# Altium schematic sheet schematic.SchDoc
size A2
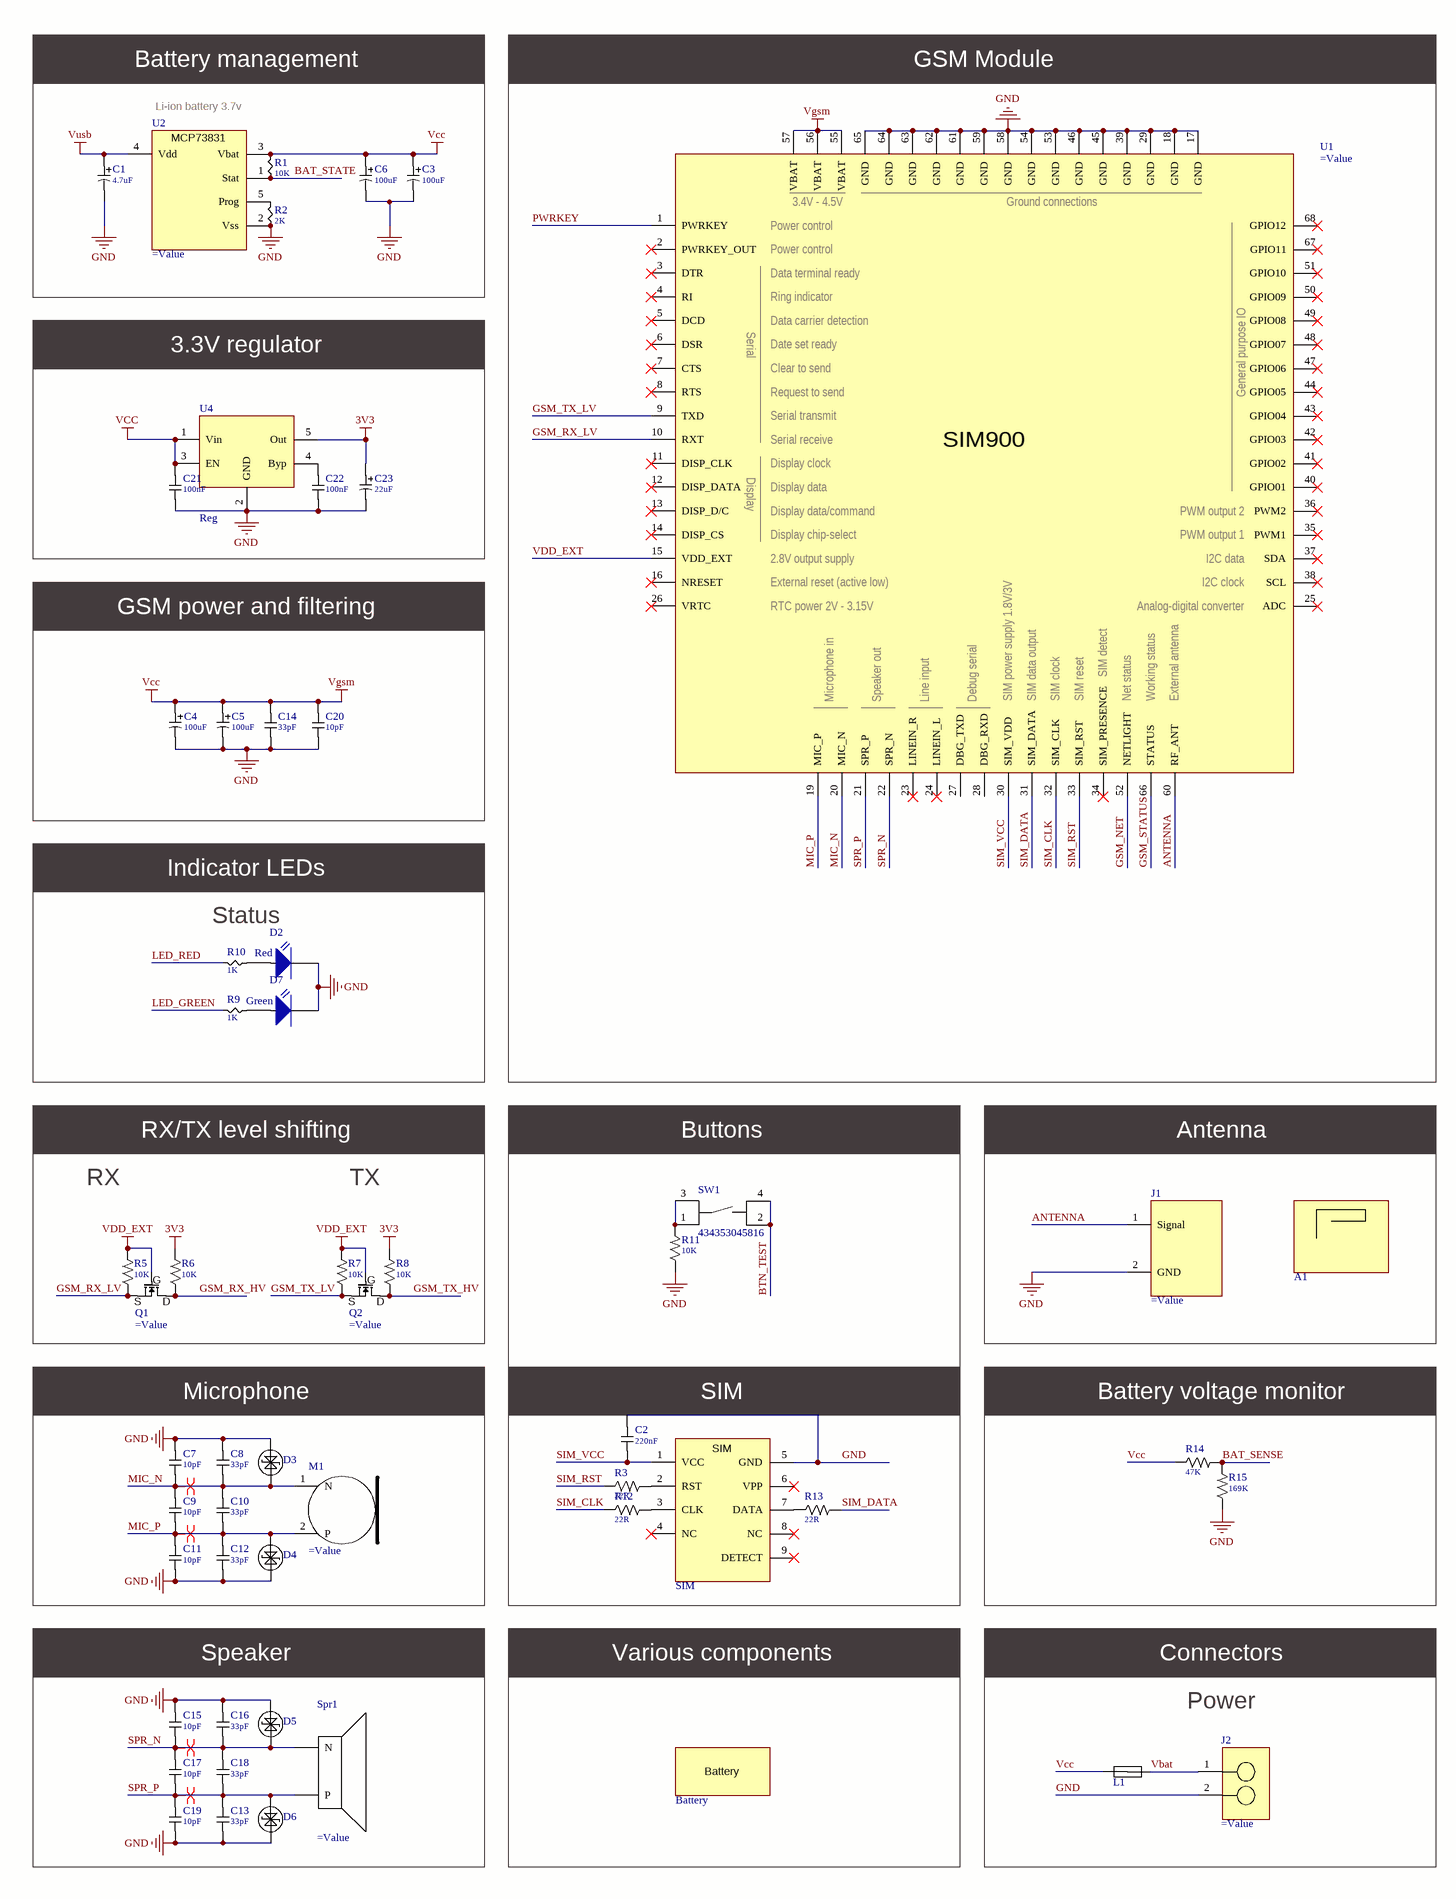
[diagram p0: schematic.SchDoc, left]
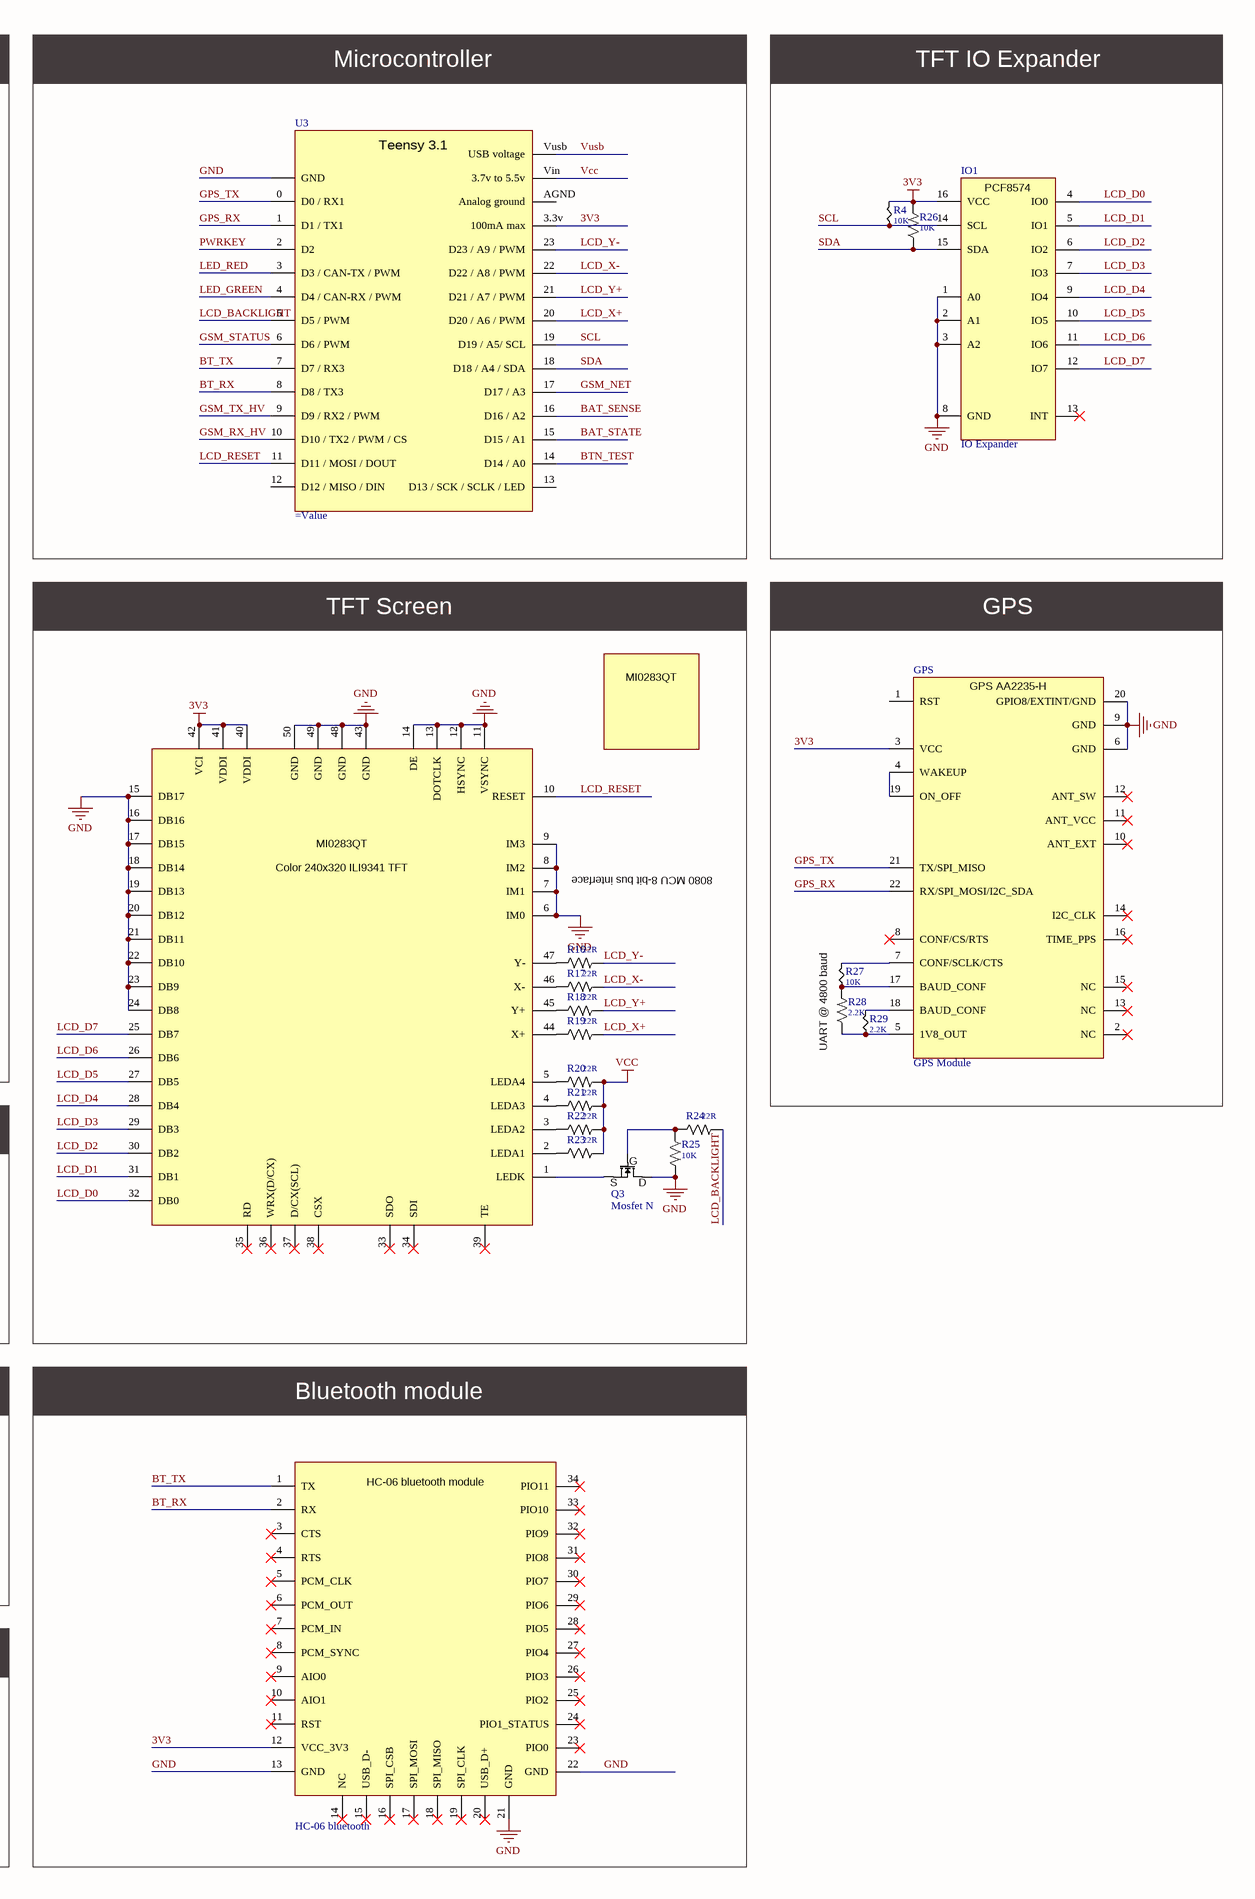
[diagram p1: schematic.SchDoc, right]

## Parts
A1  (no value)  [PCB-ANTENNA]
B1  Battery  [BATTERY-2000MAH]
BT  HC-06 bluetooth  [HC-06-BLUETOOTH]
C1  4.7uF  [CAP-0603-POL]
C2  value 220nF  [CAP-0603-GEN]  (hidden comment: CAPACITOR)
C3  100uF  [CAP-1206-POL]
C4  100uF  [CAP-1206-POL]
C5  100uF  [CAP-1206-POL]
C6  100uF  [CAP-1206-POL]
C7  10pF  [CAP-0603-GEN]
C8  33pF  [CAP-0603-GEN]
C9  10pF  [CAP-0603-GEN]
C10  33pF  [CAP-0603-GEN]
C11  10pF  [CAP-0603-GEN]
C12  33pF  [CAP-0603-GEN]
C13  33pF  [CAP-0603-GEN]
C14  33pF  [CAP-0603-GEN]
C15  10pF  [CAP-0603-GEN]
C16  33pF  [CAP-0603-GEN]
C17  10pF  [CAP-0603-GEN]
C18  33pF  [CAP-0603-GEN]
C19  10pF  [CAP-0603-GEN]
C20  10pF  [CAP-0603-GEN]
C21  value 100nF  [CAP-0603-GEN]  (hidden comment: CAPACITOR)
C22  value 100nF  [CAP-0603-GEN]  (hidden comment: CAPACITOR)
C23  value 22uF  [CAP-0603-POL]  (hidden comment: CAPACITOR-POLARIZED)
D2  Color: Red  [LED-0603]  (hidden comment: LED)
D3  (no value)  [ESD-SUPRESSOR-0603]
D4  (no value)  [ESD-SUPRESSOR-0603]
D5  (no value)  [ESD-SUPRESSOR-0603]
D6  (no value)  [ESD-SUPRESSOR-0603]
D7  Color: Green  [LED-0603]  (hidden comment: LED)
GPS  GPS Module  [GPS-A2235-H]
IO1  IO Expander  [SOIC-16-WIDE]
J1  (no value)  [ANTENNA-CONNECTOR]
J2  (no value)  [JST-PH-1x2]
L1  (no value)  [FERRITE-1206]
M1  (no value)  [MICROPHONE]
Q1  (no value)  [SOT23-3]
Q2  (no value)  [SOT23-3]
Q3  Mosfet N  [SOT23-3]
R1  10K  [RESISTOR-0603]
R2  2K  [RESISTOR-0603]
R3  22R  [RESISTOR-0603]
R4  value 10K  [RESISTOR-0603]  (hidden comment: Resistor)
R5  10K  [RESISTOR-0603]
R6  10K  [RESISTOR-0603]
R7  10K  [RESISTOR-0603]
R8  10K  [RESISTOR-0603]
R9  1K  [RESISTOR-0603]
R10  1K  [RESISTOR-0603]
R11  10K  [RESISTOR-0603]
R12  22R  [RESISTOR-0603]
R13  22R  [RESISTOR-0603]
R14  47K  [RESISTOR-0603]
R15  169K  [RESISTOR-0603]
R16  value 22R  [RESISTOR-0603]  (hidden comment: RESISTOR)
R17  value 22R  [RESISTOR-0603]  (hidden comment: RESISTOR)
R18  value 22R  [RESISTOR-0603]  (hidden comment: RESISTOR)
R19  value 22R  [RESISTOR-0603]  (hidden comment: RESISTOR)
R20  value 22R  [RESISTOR-0603]  (hidden comment: RESISTOR)
R21  value 22R  [RESISTOR-0603]  (hidden comment: RESISTOR)
R22  value 22R  [RESISTOR-0603]  (hidden comment: RESISTOR)
R23  value 22R  [RESISTOR-0603]  (hidden comment: RESISTOR)
R24  value 22R  [RESISTOR-0603]  (hidden comment: RESISTOR)
R25  value 10K  [RESISTOR-0603]  (hidden comment: RESISTOR)
R26  value 10K  [RESISTOR-0603]  (hidden comment: RESISTOR)
R27  value 10K  [RESISTOR-0603]  (hidden comment: Resistor)
R28  value 2.2K  [RESISTOR-0603]  (hidden comment: RESISTOR)
R29  value 2.2K  [RESISTOR-0603]  (hidden comment: Resistor)
SIM  SIM  [WURTH-SIM-693023010811]  (value not drawn)
Spr1  (no value)  [SPEAKER-SR6438NWS-000]
SW1  434353045816  [WURTH-TACTILE-434353045816]
TFT1  TFT  [FCI-62684-50210E9ALF]  (value not drawn)
TFT2  Screen  [MI0283QT]  (value not drawn)
U1  (no value)  [SIM900]
U2  (no value)  [SOT23-5]
U3  (no value)  [TEENSY-3.1]
U4  Reg  [SOT23-5]

## Blocks framed on the sheet
Battery management: C1 C3 C6 R1 R2 U2
GSM Module: U1
Microcontroller: U3
TFT IO Expander: IO1 R4 R26
3.3V regulator: C21-C23 U4
GSM power and filtering: C4 C5 C14 C20
TFT Screen: Q3 R16-R25 TFT1 TFT2
GPS: GPS R27-R29
Buttons: R11 SW1
Antenna: A1 J1
Microphone: C7-C12 D3 D4 M1
SIM: C2 R3 R12 R13 SIM
Battery voltage monitor: R14 R15
Bluetooth module: BT
Speaker: C13 C15-C19 D5 D6 Spr1
Various components: B1

## Nets
3V3: BT.12(VCC_3V3) C23.1 GPS.3(VCC) IO1.16(VCC) R4.2 R6.2 R8.2 R26.2 TFT1.40(VDDI) TFT1.41(VDDI) TFT1.42(VCI) U3.3.3v(100mA_max) U4.5(Out)
GND: BT.13(GND) BT.21(GND) BT.22(GND) C1.2 C2.2 C3.2 C4.2 C5.2 C6.2 C7.2 C8.2 C11.1 C12.1 C13.1 C14.1 C15.2 C16.2 C19.1 C20.1 C21.1 C22.1 C23.2 D2.2(Cathode) D3.1 D4.2 D5.1 D6.2 D7.2(Cathode) GPS.6(GND) GPS.9(GND) GPS.20(GPIO8/EXTINT/GND) IO1.1(A0) IO1.2(A1) IO1.3(A2) IO1.8(GND) J1.2(GND) J2.2 Q3.3(Drain) R2.1 R11.1 R15.1 R25.2 SIM.5(GND) TFT1.6(IM0) TFT1.7(IM1) TFT1.8(IM2) TFT1.9(IM3) TFT1.11(VSYNC) TFT1.12(HSYNC) TFT1.13(DOTCLK) TFT1.14(DE) TFT1.15(DB17) TFT1.16(DB16) TFT1.17(DB15) TFT1.18(DB14) TFT1.19(DB13) TFT1.20(DB12) TFT1.21(DB11) TFT1.22(DB10) TFT1.23(DB9) TFT1.24(DB8) TFT1.43(GND) TFT1.48(GND) TFT1.49(GND) TFT1.50(GND) U1.17(GND) U1.18(GND) U1.29(GND) U1.39(GND) U1.45(GND) U1.46(GND) U1.53(GND) U1.54(GND) U1.58(GND) U1.59(GND) U1.61(GND) U1.62(GND) U1.63(GND) U1.64(GND) U1.65(GND) U2.2(Vss) U3.GND U4.2(GND)
Vcc: C3.1 C4.1 C5.1 C6.1 C14.2 C20.2 C21.2 L1.1 R1.2 R14.1 R20.2 R21.2 R22.2 R23.2 U1.55(VBAT) U1.56(VBAT) U1.57(VBAT) U2.3(Vbat) U3.Vin(3.7v_to_5.5v) U4.1(Vin) U4.3(EN)  [also labelled Vgsm]
VDD_EXT: Q1.1(Gate) Q2.1(Gate) R5.2 R7.2 U1.15(VDD_EXT)
Vusb: C1.1 U2.4(Vdd) U3.Vusb(USB_voltage)
ANTENNA: J1.1(Signal) U1.60(RF_ANT)
BAT_SENSE: R14.2 R15.2 U3.16(D16_/_A2)
BAT_STATE: R1.1 U2.1(Stat) U3.15(D15_/_A1)
BT_RX: BT.2(RX) U3.8(D8_/_TX3)
BT_TX: BT.1(TX) U3.7(D7_/_RX3)
BTN_TEST: SW1.2 SW1.4 U3.14(D14_/_A0)
GPS_RX: GPS.22(RX/SPI_MOSI/I2C_SDA) U3.1(D1_/_TX1)
GPS_TX: GPS.21(TX/SPI_MISO) U3.0(D0_/_RX1)
GSM_NET: U1.52(NETLIGHT) U3.17(D17_/_A3)
GSM_RX_HV: Q1.3(Drain) R6.1 U3.10(D10_/_TX2_/_PWM_/_CS)
GSM_RX_LV: Q1.2(Source) R5.1 U1.10(RXT)
GSM_STATUS: U1.66(STATUS) U3.6(D6_/_PWM)
GSM_TX_HV: Q2.3(Drain) R8.1 U3.9(D9_/_RX2_/_PWM)
GSM_TX_LV: Q2.2(Source) R7.1 U1.9(TXD)
LCD_BACKLIGHT: R24.2 U3.5(D5_/_PWM)
LCD_D0: IO1.4(IO0) TFT1.32(DB0)
LCD_D1: IO1.5(IO1) TFT1.31(DB1)
LCD_D2: IO1.6(IO2) TFT1.30(DB2)
LCD_D3: IO1.7(IO3) TFT1.29(DB3)
LCD_D4: IO1.9(IO4) TFT1.28(DB4)
LCD_D5: IO1.10(IO5) TFT1.27(DB5)
LCD_D6: IO1.11(IO6) TFT1.26(DB6)
LCD_D7: IO1.12(IO7) TFT1.25(DB7)
LCD_RESET: TFT1.10(RESET) U3.11(D11_/_MOSI_/_DOUT)
LCD_X+: R19.2 U3.20(D20_/_A6_/_PWM)
LCD_X-: R17.2 U3.22(D22_/_A8_/_PWM)
LCD_Y+: R18.2 U3.21(D21_/_A7_/_PWM)
LCD_Y-: R16.2 U3.23(D23_/_A9_/_PWM)
LED_GREEN: R9.2 U3.4(D4_/_CAN-RX_/_PWM)
LED_RED: R10.2 U3.3(D3_/_CAN-TX_/_PWM)
MIC_N: C7.1 C8.1 C9.2 C10.2 D3.2 M1.1(N) U1.20(MIC_N)
MIC_P: C9.1 C10.1 C11.2 C12.2 D4.1 M1.2(P) U1.19(MIC_P)
PWRKEY: U1.1(PWRKEY) U3.2(D2)
SCL: IO1.14(SCL) R4.1 U3.19(D19_/_A5/_SCL)
SDA: IO1.15(SDA) R26.1 U3.18(D18_/_A4_/_SDA)
SIM_CLK: R12.1 U1.32(SIM_CLK)
SIM_DATA: R13.2 U1.31(SIM_DATA)
SIM_RST: R3.1 U1.33(SIM_RST)
SIM_VCC: C2.1 SIM.1(VCC) U1.30(SIM_VDD)
SPR_N: C15.1 C16.1 C17.2 C18.2 D5.2 Spr1.1(N) U1.22(SPR_N)
SPR_P: C13.2 C17.1 C18.1 C19.2 D6.1 Spr1.2(P) U1.21(SPR_P)
Vbat: J2.1 L1.2
NetC22_2: C22.2 U4.4(Byp)
NetD2_1: D2.1(Anode) R10.1
NetD7_1: D7.1(Anode) R9.1
NetGPS_4: GPS.4(WAKEUP) GPS.19(ON_OFF)
NetGPS_5: GPS.5(1V8_OUT) R28.1 R29.1
NetGPS_7: GPS.7(CONF/SCLK/CTS) R27.2
NetGPS_17: GPS.17(BAUD_CONF) R27.1 R28.2
NetGPS_18: GPS.18(BAUD_CONF) R29.2
NetQ3_1: Q3.1(Gate) R24.1 R25.1
NetQ3_2: Q3.2(Source) TFT1.1(LEDK)
NetR2_2: R2.2 U2.5(Prog)
NetR3_2: R3.2 SIM.2(RST)
NetR11_2: R11.2 SW1.1 SW1.3
NetR12_2: R12.2 SIM.3(CLK)
NetR13_1: R13.1 SIM.7(DATA)
NetR16_1: R16.1 TFT1.47(Y-)
NetR17_1: R17.1 TFT1.46(X-)
NetR18_1: R18.1 TFT1.45(Y+)
NetR19_1: R19.1 TFT1.44(X+)
NetR20_1: R20.1 TFT1.5(LEDA4)
NetR21_1: R21.1 TFT1.4(LEDA3)
NetR22_1: R22.1 TFT1.3(LEDA2)
NetR23_1: R23.1 TFT1.2(LEDA1)

Not connected (* = marked no-connect by the designer): BT 3(CTS)* 4(RTS)* 5(PCM_CLK)* 6(PCM_OUT)* 7(PCM_IN)* 8(PCM_SYNC)* 9(AIO0)* 10(AIO1)* 11(RST)* 14(NC)* 15(USB_D-)* 16(SPI_CSB)* 17(SPI_MOSI)* 18(SPI_MISO)* 19(SPI_CLK)* 20(USB_D+)* 23(PIO0)* 24(PIO1_STATUS)* 25(PIO2)* 26(PIO3)* 27(PIO4)* 28(PIO5)* 29(PIO6)* 30(PIO7)* 31(PIO8)* 32(PIO9)* 33(PIO10)* 34(PIO11)*; GPS 1(RST) 2(NC)* 8(CONF/CS/RTS)* 10(ANT_EXT)* 11(ANT_VCC)* 12(ANT_SW)* 13(NC)* 14(I2C_CLK)* 15(NC)* 16(TIME_PPS)*; IO1 13(INT)*; SIM 4(NC)* 6(VPP)* 8(NC)* 9(DETECT)*; TFT1 33(SDO)* 34(SDI)* 35(RD)* 36(WRX(D/CX))* 37(D/CX(SCL))* 38(CSX)* 39(TE)*; U1 2(PWRKEY_OUT)* 3(DTR)* 4(RI)* 5(DCD)* 6(DSR)* 7(CTS)* 8(RTS)* 11(DISP_CLK)* 12(DISP_DATA)* 13(DISP_D/C)* 14(DISP_CS)* 16(NRESET)* 23(LINEIN_R)* 24(LINEIN_L)* 25(ADC)* 26(VRTC)* 27(DBG_TXD) 28(DBG_RXD) 34(SIM_PRESENCE)* 35(PWM1)* 36(PWM2)* 37(SDA)* 38(SCL)* 40(GPIO01)* 41(GPIO02)* 42(GPIO03)* 43(GPIO04)* 44(GPIO05)* 47(GPIO06)* 48(GPIO07)* 49(GPIO08)* 50(GPIO09)* 51(GPIO10)* 67(GPIO11)* 68(GPIO12)*; U3 12(D12_/_MISO_/_DIN) 13(D13_/_SCK_/_SCLK_/_LED) AGND(Analog_ground)

## Layout directives
differential pair: MIC_N, MIC_P, SPR_N, SPR_P

## Notes on the sheet
- Li-ion battery 3.7v
- Indicator LEDs
- (near TFT1) 8080 MCU 8-bit bus interface
- Status
- UART @ 4800 baud
- RX/TX level shifting
- RX
- TX
- Connectors
- Power
- (in symbol BATTERY-CHARGER-MCP73831) MCP73831
- (in symbol GPS-A2235-H) GPS AA2235-H
- (in symbol MI0283QT-11) MI0283QT; Color 240x320 ILI9341 TFT
- (in symbol MOSFET-N) G; S; D
- (in symbol PCF8574-IO-EXPANDER) PCF8574
- (in symbol SIM900) 3.4V - 4.5V; Ground connections; Power control; Data terminal ready; Ring indicator; Data carrier detection; Serial; Date set ready; General purpose IO; Clear to send; Request to send; Serial transmit; Serial receive; Display clock; Display data; Display; Display data/command; PWM output 2; Display chip-select; PWM output 1; 2.8V output supply; I2C data; External reset (active low); I2C clock; RTC power 2V - 3.15V; Analog-digital converter; SIM detect; Microphone in; Speaker out; Line input; Debug serial; SIM power supply 1.8V/3V; SIM data output; SIM clock; SIM reset; Net status; Working status; External antenna
- (in symbol TEENSY-3.1) Teensy 3.1

## Library data of the parts
A1 = PCB-ANTENNA: PCB GSM antenna
BT = HC-06-BLUETOOTH: HC-06 bluetooth module
C1 C3-C6 C23 = CAPACITOR-POLARIZED: Polarized capacitor
  C1: Value: 4.7uF
  C3-C6: Value: 100uF
C7-C20 = CAPACITOR
  C7 C9 C11 C15 C17 C19 C20: Value: 10pF
  C8 C10 C12-C14 C16 C18: Value: 33pF
D3-D6 = ESD-SUPRESSOR: ESD supressor diode
GPS = GPS-A2235-H
IO1 = PCF8574-IO-EXPANDER: 8 pin i2c IO expander
J1 = ANTENNA-CONNECTOR: Antenna connector
J2 = CONNECTOR-1x2: Single row two contact connector
L1 = FERRITE-BEAD: Ferrite bead
M1 = MICROPHONE
Q1-Q3 = MOSFET-N: N-channel mosfet
R1 R2 R9 R10 = RESISTOR-SMALL: Resistor
  R1: Value: 10K
  R2: Value: 2K
  R9 R10: Value: 1K
R3 R5-R8 R11-R15 = RESISTOR
  R3 R12 R13: Value: 22R
  R5-R8 R11: Value: 10K
  R14: Value: 47K
  R15: Value: 169K
R4 R27 R29 = RESISTOR-SMALL
SIM = MICRO-SIM: Micro SIM card holder
Spr1 = SPEAKER
SW1 = WURTH-TACTILE-434353045816: WS-TASU SMD Tact Switch 4.7X3.5 mm side push; Manufacturer: WØ¹rth Elektronik eiSos GmbH & Co.KG; partNo: 434351045816; ComponentLink1 Description: Manufacturer; ComponentLink2 Description: Datasheet; Creat by: Karrer Zheng; NoPins: 04; Creat Date: 6 March February 2014; ComponentLink1URL: http://www.we-online.com; ComponentLink2URL: http://katalog.we-online.de/em/datasheet/434351045816.pdf
TFT1 = MI0283QT-11: MI0283QT 2.8" TFT
TFT2 = MI0283QT: MI0283QT TFT screen
U1 = SIM900: SIM900 GSM Module
U2 = BATTERY-CHARGER-MCP73831: Single cell battery management
U3 = TEENSY-3.1: Teensy 3.1 breakout
U4 = SOT23-REG: Voltage regulator